# EAGLE design modEEGdigital_v1.1 (EAGLE 4.09)
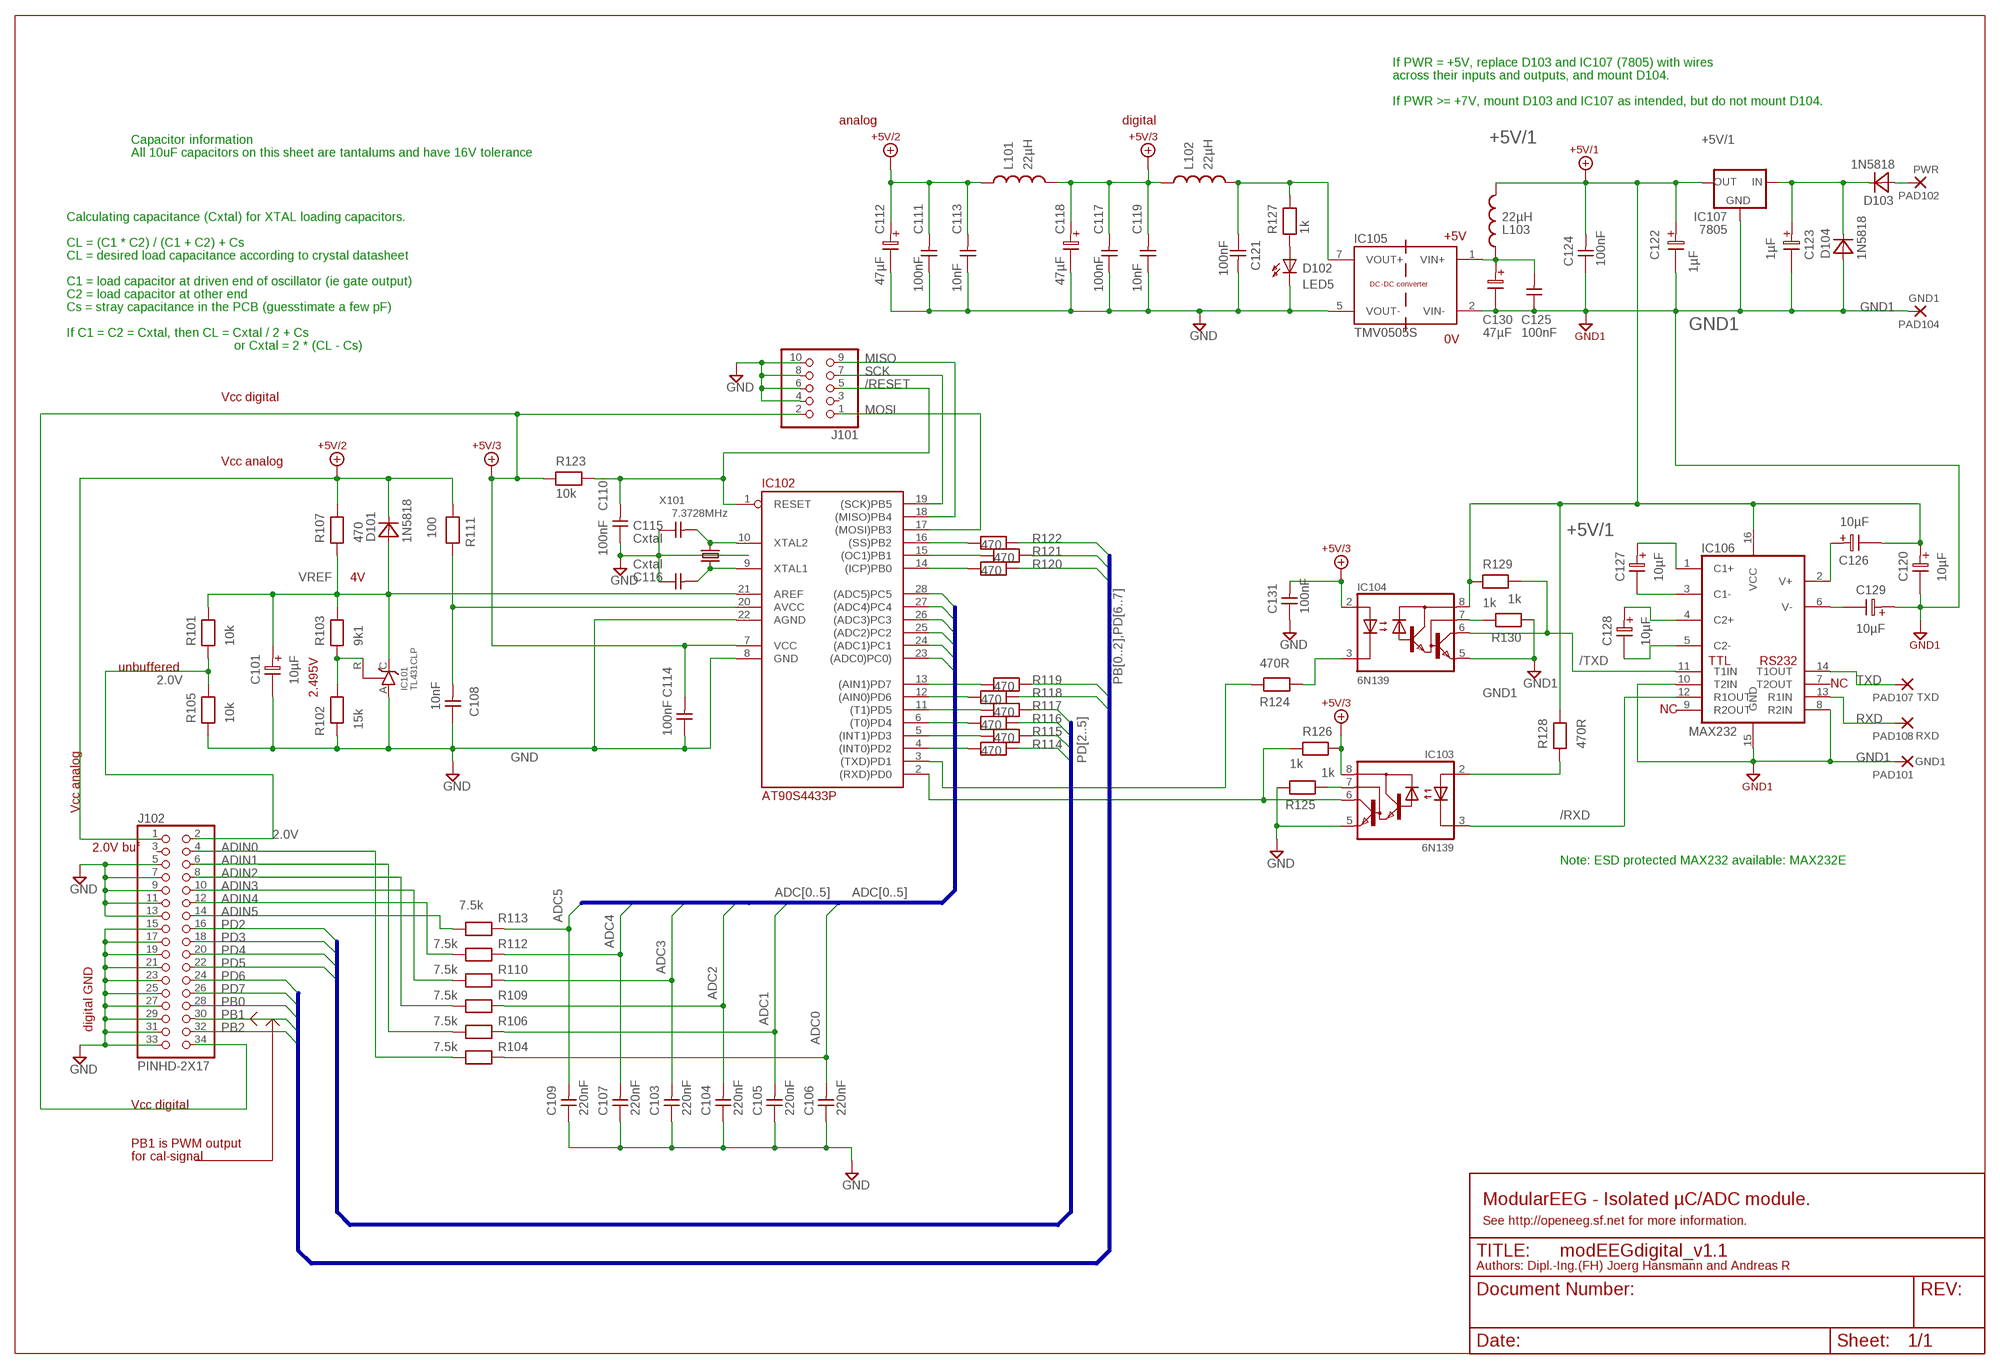
[diagram p0: schematic, sheet 1]

## Parts
C101  10µF  ELC-5  [EL25B]
C103  220nF  CAPNP-5  [C-5]
C104  220nF  CAPNP-5  [C-5]
C105  220nF  CAPNP-5  [C-5]
C106  220nF  CAPNP-5  [C-5]
C107  220nF  CAPNP-5  [C-5]
C108  10nF  CAPNP-5  [C-5]
C109  220nF  CAPNP-5  [C-5]
C110  100nF  CAPNP-5  [C-5]
C111  100nF  CAPNP-5  [C-5]
C112  47µF  ELC-5  [EL25B]
C113  10nF  CAPNP-5  [C-5]
C114  100nF  CAPNP-5  [C-5]
C115  Cxtal  CAPNP-5  [C-5]
C116  Cxtal  CAPNP-5  [C-5]
C117  100nF  CAPNP-5  [C-5]
C118  47µF  ELC-5  [EL25B]
C119  10nF  CAPNP-5  [C-5]
C120  10µF  ELC-5  [EL25B]
C121  100nF  CAPNP-5@2  [C-5@1]
C122  1µF  ELC-2,5  [EL25B]
C123  1µF  ELC-2,5  [EL25B]
C124  100nF  CAPNP-5@2  [C-5@1]
C125  100nF  CAPNP-5  [C-5]
C126  10µF  ELC-5  [EL25B]
C127  10µF  ELC-5  [EL25B]
C128  10µF  ELC-5  [EL25B]
C129  10µF  ELC-5  [EL25B]
C130  47µF  ELC-5  [EL25B]
C131  100nF  CAPNP-5  [C-5]
D101  1N5818  DIODE-10  [D-10]
D102  LED5  [LED5]
D103  1N5818  DIODE-12,5  [D-12,5]
D104  1N5818  DIODE-12,5  [D-12,5]
IC101  TL431CLP  [TO92-CLP]
IC102  AT90S4433P  90S4433-P  [DIL-28/3]
IC103  6N139  HCPL0700  [DIL-08]
IC104  6N139  HCPL0700  [DIL-08]
IC105  TMV0505S  TMV0505  [TMADCDC]
IC106  MAX232  [DIL-16]
IC107  7805  78XXS  [78XXL_S]
J101  PINHD-2X5  [2X05]
J102  PINHD-2X17  [2X17]
L101  22µH  L-10  [R-12,5]
L102  22µH  L-10  [R-12,5]
L103  22µH  L-10  [R-12,5]
PAD101  GND1  1,6/0,8  [WIREPAD1]
PAD102  PWR  1,6/0,8  [WIREPAD1]
PAD104  GND1  1,6/0,8  [WIREPAD1]
PAD107  TXD  1,6/0,8  [WIREPAD1]
PAD108  RXD  1,6/0,8  [WIREPAD1]
R101  10k  RESEU-10  [R-10]
R102  15k  RESEU-10  [R-10]
R103  9k1  RESEU-10  [R-10]
R104  7.5k  RESEU-10  [R-10]
R105  10k  RESEU-10  [R-10]
R106  7.5k  RESEU-10  [R-10]
R107  470  RESEU-10  [R-10]
R109  7.5k  RESEU-10  [R-10]
R110  7.5k  RESEU-10  [R-10]
R111  100  RESEU-10  [R-10]
R112  7.5k  RESEU-10  [R-10]
R113  7.5k  RESEU-10  [R-10]
R114  470  RESEU-10  [R-10]
R115  470  RESEU-10  [R-10]
R116  470  RESEU-10  [R-10]
R117  470  RESEU-10  [R-10]
R118  470  RESEU-10  [R-10]
R119  470  RESEU-10  [R-10]
R120  470  RESEU-10  [R-10]
R121  470  RESEU-10  [R-10]
R122  470  RESEU-10  [R-10]
R123  10k  RESEU-10@2  [R-10]
R124  470R  RESEU-10  [R-10]
R125  1k  RESEU-10  [R-10]
R126  1k  RESEU-10  [R-10]
R127  1k  RESEU-10@2  [R-10]
R128  470R  RESEU-10  [R-10]
R129  1k  RESEU-10  [R-10]
R130  1k  RESEU-10  [R-10]
X101  7.3728MHz  HC49/S  [HC49/S]

## Nets
2.0V: J102.2 R101.1 R105.2
+5V/1: C120.1 C122.1 C124.2 C126.2 IC104.8(VCC) IC106.16(VCC) IC107.OUT L103.2 R128.2 R129.1
+5V/2: C111.2 C112.1 C113.2 D101.2(K) J102.1 L101.1 R107.2 R111.1
+5V/3: C114.2 C117.2 C118.1 C119.2 C131.2 IC102.7(VCC) IC103.8(VCC) IC104.2(A) J101.2 J102.34 L101.2 L102.1 R123.1 R126.2
+6TO12V: C123.1 D103.2(K) D104.2(K) IC107.IN
/RESET: C110.2 IC102.1(RESET) J101.5 R123.2
/RXD: IC103.3(K) IC106.12(R1OUT)
/TXD: IC104.6(VO) IC106.11(T1IN) R129.2
ADC0: C106.2 IC102.23((ADC0)PC0)) R104.2
ADC1: C105.2 IC102.24((ADC1)PC1) R106.2
ADC2: C104.2 IC102.25((ADC2)PC2) R109.2
ADC3: C103.2 IC102.26((ADC3)PC3) R110.2
ADC4: C107.2 IC102.27((ADC4)PC4) R112.2
ADC5: C109.2 IC102.28((ADC5)PC5) R113.2
ADIN0: J102.4 R104.1
ADIN1: J102.6 R106.1
ADIN2: J102.8 R109.1
ADIN3: J102.10 R110.1
ADIN4: J102.12 R112.1
ADIN5: J102.14 R113.1
AVCC: C108.2 IC102.20(AVCC) R111.2
GND: C101.2 C103.1 C104.1 C105.1 C106.1 C107.1 C108.1 C109.1 C110.1 C111.1 C112.2 C113.1 C114.1 C115.1 C116.1 C117.1 C118.2 C119.1 C121.2 C131.1 D102.K IC101.A IC102.8(GND) IC102.22(AGND) IC103.5(GND) IC105.5(VOUT-) J101.4 J101.6 J101.8 J101.10 J102.5 J102.7 J102.9 J102.11 J102.13 J102.15 J102.17 J102.19 J102.21 J102.23 J102.25 J102.27 J102.29 J102.31 J102.33 R102.1 R105.1 R125.2
GND1: C120.2 C122.2 C123.2 C124.1 C125.1 C129.1 C130.2 D104.1(A) IC104.5(GND) IC105.2(VIN-) IC106.8(R2IN) IC106.10(T2IN) IC106.15(GND) IC107.GND PAD101.1(P) PAD104.1(P) R130.1
MISO: IC102.18((MISO)PB4) J101.9
MOSI: IC102.17((MOSI)PB3) J101.1
N$1: IC102.4((INT0)PD2) R114.1
N$2: IC102.5((INT1)PD3) R115.1
N$3: IC102.6((T0)PD4) R116.1
N$4: IC101.R R102.2 R103.1
N$5: IC102.11((T1)PD5) R117.1
N$6: IC102.12((AIN0)PD6) R118.1
N$7: IC102.13((AIN1)PD7) R119.1
N$8: IC104.3(K) R124.1
N$9: IC102.14((ICP)PB0) R120.1
N$10: C116.2 IC102.9(XTAL1) X101.1
N$11: IC102.15((OC1)PB1) R121.1
N$12: IC102.16((SS)PB2) R122.1
N$14: C121.1 IC105.7(VOUT+) L102.2 R127.2
N$15: D102.A R127.1
N$18: D103.1(A) PAD102.1(P)
N$25: C115.2 IC102.10(XTAL2) X101.2
N$36: C128.1 IC106.4(C2+)
N$37: C128.2 IC106.5(C2-)
N$38: C127.2 IC106.3(C1-)
N$40: C127.1 IC106.1(C1+)
N$42: C129.2 IC106.6(V-)
N$43: C126.1 IC106.2(V+)
N$44: C125.2 C130.1 IC105.1(VIN+) L103.1
N$52: IC104.7(VB) R130.2
N$53: IC103.7(VB) R125.1
N$61: IC103.2(A) R128.1
PB0: J102.28 R120.2
PB1: J102.30 R121.2
PB2: J102.32 R122.2
PD0: IC102.2((RXD)PD0) IC103.6(VO) R126.1
PD1: IC102.3((TXD)PD1) R124.2
PD2: J102.16 R114.2
PD3: J102.18 R115.2
PD4: J102.20 R116.2
PD5: J102.22 R117.2
PD6: J102.24 R118.2
PD7: J102.26 R119.2
RXD: IC106.13(R1IN) PAD108.1(P)
SCK: IC102.19((SCK)PB5) J101.7
TXD: IC106.14(T1OUT) PAD107.1(P)
VREF: C101.1 D101.1(A) IC101.C IC102.21(AREF) R101.2 R103.2 R107.1
Unconnected: IC106.7(T2OUT) IC106.9(R2OUT) J101.3 J102.3

## Buses
ADC[0..5]
PD[2..5]
PB[0..2],PD[6..7]

## Notes on the sheet
- If PWR = +5V, replace D103 and IC107 (7805) with wires
- across their inputs and outputs, and mount D104.
- If PWR >= +7V, mount D103 and IC107 as intended, but do not mount D104.
- analog | digital
- Capacitor information
- All 10uF capacitors on this sheet are tantalums and have 16V tolerance
- Calculating capacitance (Cxtal) for XTAL loading capacitors.
- +5V
- CL = (C1 * C2) / (C1 + C2) + Cs
- CL = desired load capacitance according to crystal datasheet
- C1 = load capacitor at driven end of oscillator (ie gate output)
- C2 = load capacitor at other end
- Cs = stray capacitance in the PCB (guesstimate a few pF)
- If C1 = C2 = Cxtal, then CL = Cxtal / 2 + Cs
- 0V
- or Cxtal = 2 * (CL - Cs)
- Vcc digital
- Vcc analog
- 4V
- TTL | RS232
- unbuffered
- NC
- 2.495V
- NC
- Vcc analog
- 2.0V buf
- Note: ESD protected MAX232 available: MAX232E
- digital GND
- Vcc digital
- PB1 is PWM output
- for cal-signal
- ModularEEG - Isolated µC/ADC module.
- See http://openeeg.sf.net for more information.
- Authors: Dipl.-Ing.(FH) Joerg Hansmann and Andreas R

## Library data of the parts
C101 C112 C118 C120 C126-C130 = DISCRETE:ELC-5
C103-C111 C113-C117 C119 C125 C131 = DISCRETE:CAPNP-5
C121 C124 = DISCRETE:CAPNP-5@2
C122 C123 = DISCRETE@2:ELC-2,5
D101 = DISCRETE:DIODE-10
D102 = LED:LED5
D103 D104 = DISCRETE:DIODE-12,5
IC101 = V-REG:TL431CLP
IC102 = atmel:90S4433-P
IC103 IC104 = OPTOCPL:HCPL0700
IC105 = modEEG:TMV0505
IC106 = MAXIM:MAX232
IC107 = V-REG@2:78XXS
J101 = PINHEAD:PINHD-2X5: PIN HEADER
J102 = PINHEAD@2:PINHD-2X17
L101-L103 = DISCRETE@2:L-10
PAD101 PAD102 PAD104 PAD107 PAD108 = WIREPAD:1,6/0,8
R101-R107 R109-R122 R124-R126 R128-R130 = DISCRETE:RESEU-10
R123 R127 = DISCRETE:RESEU-10@2
X101 = QUARTZ:HC49/S

## Board
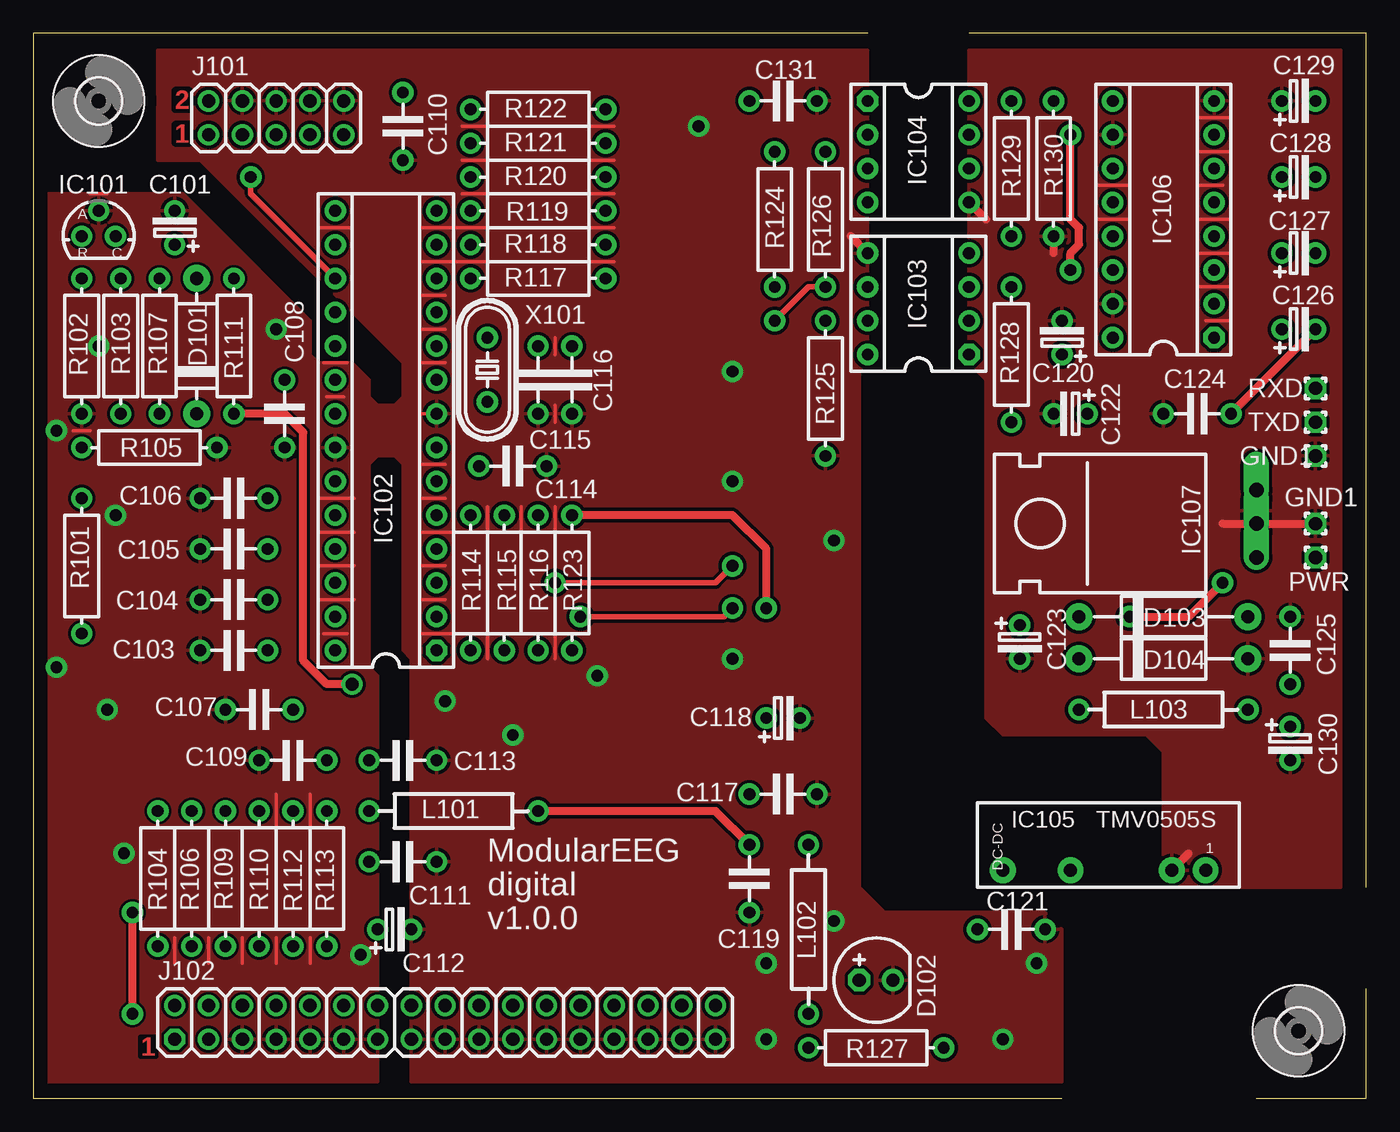
[diagram p1: board, top side]
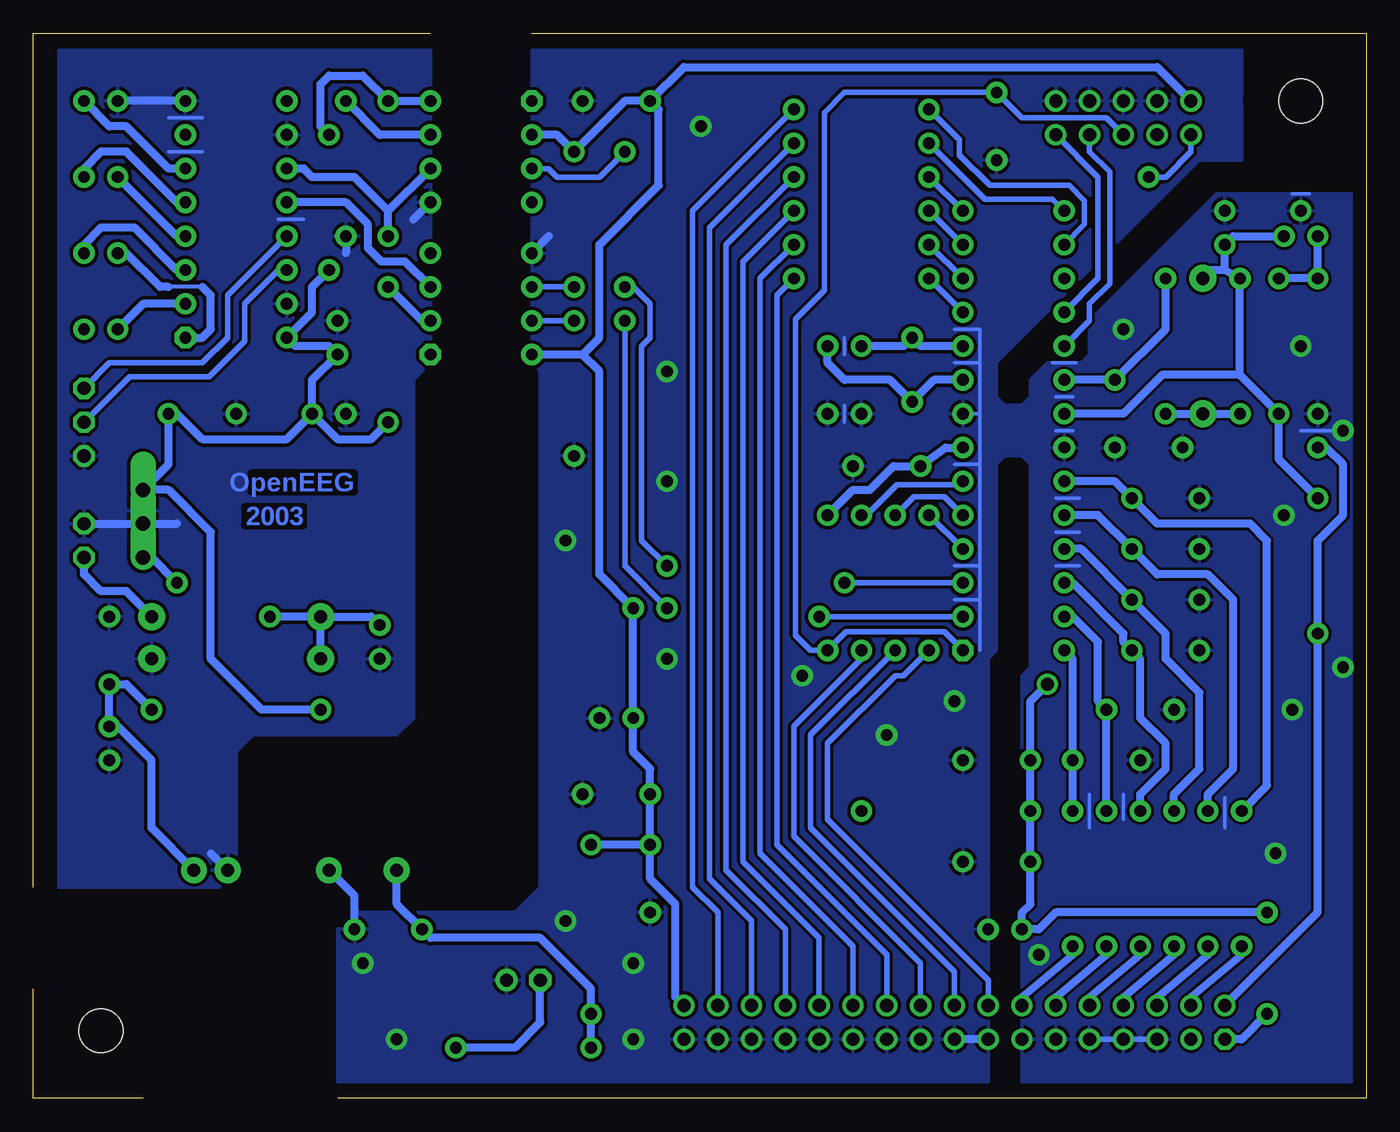
[diagram p2: board, bottom side, seen from below]

Size 100.16 x 80.01 mm. Coordinates in mm from the lower left corner, seen from the top.
Outline: 77.3,0 0,0 0,80.01 62.7,80.01 62.71,80
Outline: 91.91,0 100.16,0 100.16,8.26
Outline: 100.16,15.88 100.16,80.01 70.32,80.01 70.31,80
Copper layers used: Top, Bottom

### Footprints (pad centres in the part's own frame; a part is rotated, then mirrored left to right if it is on the bottom)
EL25B = drill 0.889 pad 1.6 round: 1 -1.27,0; 2 1.27,0
C-5 = drill 0.889 pad 1.6 round: 1 -2.54,0; 2 2.54,0
D-10 = drill 0.991 pad 2.032 round: 1 -5.08,0; 2 5.08,0
LED5 = drill 0.991 pad 1.676 octagon: A -1.27,0 | drill 0.991 pad 1.676 round: K 1.27,0
D-12,5 = drill 0.991 pad 2.032 round: 1 -6.35,0; 2 6.35,0
TO92-CLP = drill 0.889 pad 1.6 round: A 0,1.905; C 1.27,0; R -1.27,0
DIL-28/3 = drill 0.889 pad 1.6 octagon: 1 -16.51,-3.81 | drill 0.889 pad 1.6 round: 2 -13.97,-3.81; 3 -11.43,-3.81; 4 -8.89,-3.81; 5 -6.35,-3.81; 6 -3.81,-3.81; 7 -1.27,-3.81; 8 1.27,-3.81; 9 3.81,-3.81; 10 6.35,-3.81; 11 8.89,-3.81; 12 11.43,-3.81; 13 13.97,-3.81; 14 16.51,-3.81; 15 16.51,3.81; 16 13.97,3.81; 17 11.43,3.81; 18 8.89,3.81; 19 6.35,3.81; 20 3.81,3.81; 21 1.27,3.81; 22 -1.27,3.81; 23 -3.81,3.81; 24 -6.35,3.81; 25 -8.89,3.81; 26 -11.43,3.81; 27 -13.97,3.81; 28 -16.51,3.81
DIL-08 = drill 0.889 pad 1.6 octagon: 1 -3.81,-3.81 | drill 0.889 pad 1.6 round: 2 -1.27,-3.81; 3 1.27,-3.81; 4 3.81,-3.81; 5 3.81,3.81; 6 1.27,3.81; 7 -1.27,3.81; 8 -3.81,3.81
TMADCDC = drill 0.991 pad 1.93 round: 1 1.27,6.35; 2 1.27,3.81; 5 1.27,-3.81; 7 1.27,-8.89
DIL-16 = drill 0.889 pad 1.6 octagon: 1 -8.89,-3.81 | drill 0.889 pad 1.6 round: 2 -6.35,-3.81; 3 -3.81,-3.81; 4 -1.27,-3.81; 5 1.27,-3.81; 6 3.81,-3.81; 7 6.35,-3.81; 8 8.89,-3.81; 9 8.89,3.81; 10 6.35,3.81; 11 3.81,3.81; 12 1.27,3.81; 13 -1.27,3.81; 14 -3.81,3.81; 15 -6.35,3.81; 16 -8.89,3.81
78XXL_S = drill 1.092 pad 1.905 offset: GND 0,-0.635; IN -2.54,-0.635; OUT 2.54,-0.635
2X05 = drill 0.991 pad 1.6 round: 1 -5.08,-1.27; 2 -5.08,1.27; 3 -2.54,-1.27; 4 -2.54,1.27; 5 0,-1.27; 6 0,1.27; 7 2.54,-1.27; 8 2.54,1.27; 9 5.08,-1.27; 10 5.08,1.27
2X17 = drill 0.991 pad 1.6 octagon: 1 -20.32,-1.27 | drill 0.991 pad 1.6 round: 2 -20.32,1.27; 3 -17.78,-1.27; 4 -17.78,1.27; 5 -15.24,-1.27; 6 -15.24,1.27; 7 -12.7,-1.27; 8 -12.7,1.27; 9 -10.16,-1.27; 10 -10.16,1.27; 11 -7.62,-1.27; 12 -7.62,1.27; 13 -5.08,-1.27; 14 -5.08,1.27; 15 -2.54,-1.27; 16 -2.54,1.27; 17 0,-1.27; 18 0,1.27; 19 2.54,-1.27; 20 2.54,1.27; 21 5.08,-1.27; 22 5.08,1.27; 23 7.62,-1.27; 24 7.62,1.27; 25 10.16,-1.27; 26 10.16,1.27; 27 12.7,-1.27; 28 12.7,1.27; 29 15.24,-1.27; 30 15.24,1.27; 31 17.78,-1.27; 32 17.78,1.27; 33 20.32,-1.27; 34 20.32,1.27
R-12,5 = drill 0.889 pad 1.6 round: 1 -6.35,0; 2 6.35,0
WIREPAD1 = drill 0.991 pad 1.6 octagon: 1 0,0
R-10 = drill 0.889 pad 1.6 round: 1 -5.08,0; 2 5.08,0
3,3 = hole 3.3: 0,0
HC49/S = drill 0.889 pad 1.6 round: 1 -2.413,0; 2 2.413,0

### Placement (x,y rotation side)
C101  10.63,65.41 90 top
C103  15.08,33.66 0 top
C104  15.08,37.47 0 top
C105  15.08,41.27 0 top
C106  15.08,45.09 0 top
C107  16.98,29.21 0 top
C108  18.88,51.44 90 top
C109  19.52,25.4 0 top
C110  27.77,73.03 90 top
C111  27.77,17.78 180 top
C112  27.14,12.7 0 top
C113  27.77,25.4 180 top
C114  36.03,47.5 180 top
C115  37.94,53.98 90 top
C116  40.48,53.98 90 top
C117  56.35,22.86 180 top
C118  56.35,28.57 0 top
C119  53.81,16.51 90 top
C120  77.3,57.15 90 top
C121  100nF  [C-5]  73.5,12.7 0 top
C122  77.94,51.44 180 top
C123  74.13,34.29 270 top
C124  100nF  [C-5]  87.47,51.44 0 top
C125  94.45,33.66 270 top
C126  95.08,57.78 0 top
C127  95.08,63.5 0 top
C128  95.08,69.22 0 top
C129  95.08,74.93 0 top
C130  94.45,26.67 270 top
C131  56.35,74.93 180 top
D101  12.28,56.52 270 top
D102  63.34,8.89 0 top
D103  84.92,36.2 180 top
D104  84.92,33.02 180 top
IC101  4.92,64.77 0 top
IC102  26.5,50.16 90 top
IC103  66.51,59.69 90 top
IC104  66.51,71.12 270 top
IC105  81.75,18.41 270 top
IC106  84.92,66.04 90 top
IC107  91.28,43.18 90 top
J101  18.25,73.66 0 top
J102  30.95,5.71 0 top
L101  31.58,21.59 0 top
L102  58.25,12.7 270 top
L103  84.92,29.21 180 top
PAD101  96.36,48.26 0 top
PAD102  96.36,40.64 90 top
PAD104  96.36,43.18 90 top
PAD107  96.36,50.8 90 top
PAD108  96.36,53.34 90 top
R101  3.64,40.01 90 top
R102  3.64,56.52 90 top
R103  6.57,56.52 270 top
R104  9.36,16.51 90 top
R105  8.73,48.9 180 top
R106  11.9,16.51 90 top
R107  9.49,56.52 270 top
R109  14.44,16.51 90 top
R110  16.98,16.51 90 top
R111  15.08,56.52 90 top
R112  19.52,16.51 90 top
R113  22.06,16.51 90 top
R114  32.85,38.73 270 top
R115  35.39,38.73 270 top
R116  37.94,38.73 270 top
R117  37.94,61.59 0 top
R118  37.94,64.14 0 top
R119  37.94,66.67 0 top
R120  37.94,69.22 0 top
R121  37.94,71.75 0 top
R122  37.94,74.3 0 top
R123  40.48,38.73 270 top
R124  55.71,66.04 270 top
R125  59.52,53.34 270 top
R126  59.52,66.04 90 top
R127  63.34,3.81 180 top
R128  73.5,55.88 270 top
R129  73.5,69.85 270 top
R130  76.67,69.85 90 top
U$16  [3,3]  95.08,5.08 0 top
U$17  [3,3]  4.92,74.93 0 top
X101  34.12,54.74 90 top

### Tracks (layer width: path | path; a pad name or v marks a point on that pad's centre or on a via)
2.0V
  Bottom 0.61: R105.2 3.01,48.9 1.74,47.62 1.74,43.81 3.64,41.91 R101.1 3.64,13.97 J102.2
+5V/1  (via drill 0.89 pad 1.6)
  Top 0.61: v77.94,72.39 77.94,66.04 78.58,65.41 78.58,64.14 77.94,63.5 v77.94,62.23 | C124.2 C126.2
  Bottom 0.61: IC104.8 R129.1 75.4,76.83 77.94,76.83 78.58,76.2 78.58,73.03 v77.94,72.39 | v77.94,62.23 79.21,60.96 79.21,59.05 IC106.16 80.48,56.52 77.94,56.52 C120.1 79.21,53.98 C122.1 | C122.1 81.11,49.53 87.47,49.53 89.37,51.44 C124.2 90,47.62 IC107.OUT 90,45.72 86.83,42.55 86.83,33.02 83.02,29.21 L103.2 | R128.2 74.77,49.53 77.3,49.53 C122.1
+5V/2  (via drill 0.89 pad 1.6, 0.99 pad 1.6)
  Top 0.61: v7.46,6.35 v7.46,13.97 | v23.96,31.11 22.06,31.11 20.28,32.89 20.28,50.04 18.88,51.44 R111.1
  Bottom 0.61: J102.1 9.36,4.45 v7.46,6.35 | v7.46,13.97 23.33,13.97 24.6,12.7 C112.1 25.87,13.97 25.23,14.61 C111.2 L101.1 C113.2 25.23,29.84 v23.96,31.11 | R111.1 D101.2 R107.2
+5V/3  (via drill 0.89 pad 1.6)
  Top 0.61: R123.1 52.54,43.81 55.08,41.27 v55.08,36.83 | L101.2 51.27,21.59 C119.2
  Bottom 0.61: IC102.7 31.58,48.9 C114.2 35.52,47.5 37.3,45.72 38.57,45.72 R123.1 | IC104.2 60.8,72.39 R126.2 55.71,74.93 C131.2 | C131.2 51.27,77.47 15.71,77.47 J101.2 | C119.2 L102.1 | C119.2 53.81,16.51 51.91,14.61 51.91,7.62 J102.34 | C119.2 C117.2 53.81,24.77 55.08,26.04 C118.1 v55.08,36.83 57.62,39.37 57.62,54.61 58.89,55.88 | C131.2 53.17,74.3 53.17,68.58 57.62,64.14 57.62,57.15 58.89,55.88 | 58.89,55.88 IC103.8
+6TO12V  (via drill 0.89 pad 1.6)
  Top 0.61: v82.39,36.2 86.83,36.2 v89.37,38.73
  Bottom 0.61: C123.1 74.77,36.2 D103.2 | D104.2 D103.2 | D103.2 v82.39,36.2 | v89.37,38.73 91.28,40.64 IC107.IN
/RESET
  Bottom 0.406: IC102.1 31.71,35.05 39.08,35.05 R123.2 41.74,33.66 42.89,34.8 42.89,58.55 40.73,60.71 40.73,74.04 39.2,75.56 C110.2 25.87,73.66 19.52,73.66 J101.5
/RXD
  Bottom 0.61: IC103.3 72.22,62.87 74,62.87 75.02,63.88 75.02,65.66 76.67,67.31 IC106.12
/TXD
  Bottom 0.61: R129.2 73.5,66.67 | 73.5,66.67 IC104.6 | 73.5,66.67 76.03,69.22 79.21,69.22 79.84,69.85 IC106.11
ADC0
  Bottom 0.61: IC102.23 18.88,46.35 C106.2 15.71,43.18 8.73,43.18 7.46,41.91 7.46,23.5 R104.2
ADC1
  Bottom 0.61: R106.2 11.9,22.86 10,24.77 10,37.47 11.9,39.37 15.71,39.37 C105.2 20.15,43.81 IC102.24
ADC2
  Bottom 0.61: IC102.25 21.42,41.27 C104.2 15.08,34.92 15.08,33.02 12.54,30.48 12.54,24.77 14.44,22.86 R109.2
ADC3
  Bottom 0.61: IC102.26 22.06,38.73 18.25,34.92 18.25,34.29 C103.2 16.98,33.02 16.98,28.57 15.08,26.67 15.08,24.77 16.98,22.86 R110.2
ADC4
  Bottom 0.61: R112.2 C107.2 20.15,29.84 20.15,34.29 22.06,36.2 IC102.27
ADC5
  Bottom 0.61: R113.2 C109.2 22.06,33.02 IC102.28
ADIN0
  Bottom 0.61: R104.1 9.36,10.79 13.17,7.62 J102.4
ADIN1
  Bottom 0.61: R106.1 11.9,10.79 15.71,7.62 J102.6
ADIN2
  Bottom 0.61: R109.1 14.44,10.79 18.25,7.62 J102.8
ADIN3
  Bottom 0.61: R110.1 16.98,10.79 20.79,7.62 J102.10
ADIN4
  Bottom 0.61: R112.1 19.52,10.79 23.33,7.62 J102.12
ADIN5
  Bottom 0.61: R113.1 22.06,10.79 25.87,7.62 J102.14
AVCC
  Bottom 0.61: IC102.20 C108.2 15.08,57.78 R111.2
GND  (via drill 0.89 pad 1.6)
  Top 0.254: 39.2,55.88 39.2,57.15 | 39.2,50.8 39.2,52.07 | 29.04,55.24 30.95,55.24 | 29.04,57.78 30.95,57.78 | 30.95,60.33 29.04,60.33 29.04,57.78 | 34.12,62.87 29.04,62.87 29.04,65.41 34.12,65.41 34.12,67.94 | 34.12,67.94 32.22,67.94 | 41.74,67.94 43.65,67.94 | 41.74,70.48 43.65,70.48 | 41.74,65.41 43.65,65.41 | 43.65,62.87 41.74,62.87 41.74,65.41 | 34.12,70.48 32.22,70.48 | 32.22,73.03 34.12,73.03 34.12,70.48 | 43.65,73.03 41.74,73.03 41.74,70.48 | 29.04,51.44 IC102.8 | 29.04,47.62 30.95,47.62 | 29.04,45.09 30.95,45.09 | 29.04,40.01 30.95,40.01 | 31.58,34.92 31.58,33.02 | 34.12,33.02 34.12,34.92 | 34.12,42.55 34.12,44.45 | 36.66,42.55 36.66,44.45 | 39.2,44.45 39.2,42.55 36.66,42.55 | 29.04,37.47 30.95,37.47 | 39.2,33.02 39.2,34.92 29.04,34.92 29.04,37.47 | 40.22,34.92 41.74,34.92 | 4.28,67.94 5.55,67.94 | 4.28,50.16 3.01,50.16 | 29.04,37.47 29.04,40.01 | 29.04,40.01 29.04,45.09 | 29.04,45.09 29.04,47.62 | 29.04,47.62 29.04,51.44 | 29.04,51.44 29.04,55.24 | 29.04,55.24 29.04,57.78 | 29.04,42.55 34.12,42.55 | 34.12,42.55 36.66,42.55 | 41.74,67.94 41.74,70.48 | 41.74,65.41 41.74,67.94 | 34.12,67.94 34.12,70.48 | 20.79,10.16 20.79,12.06 | 18.25,10.16 18.25,12.06 | 15.71,10.16 15.71,12.06 | 13.17,10.16 13.17,12.06 | 10.63,12.06 10.63,10.16 | 21.55,45.09 24.09,45.09 | 21.55,42.55 24.09,42.55 | 21.55,40.01 24.09,40.01 | 21.55,37.47 24.09,37.47 | 21.81,34.92 23.58,34.92 | 21.81,55.24 23.58,55.24 | 22.06,52.7 23.33,52.7 | 21.42,65.41 23.96,65.41 | 18.25,20.32 18.25,22.86 | 20.79,20.32 20.79,22.86
  Top 0.61: IC103.5 61.43,64.77
  Bottom 0.254: 30.95,57.78 29.04,57.78 29.04,55.24 | 39.2,55.88 39.2,57.15 | 29.04,55.24 30.95,55.24 | 39.2,50.8 39.2,52.07 | IC102.8 29.04,51.44 | 29.04,47.62 30.95,47.62 | 29.04,40.01 30.95,40.01 | 29.04,37.47 30.95,37.47 | 21.81,55.24 23.58,55.24 | 2.38,50.16 4.92,50.16 | 4.28,67.94 5.55,67.94 | 29.04,51.44 29.04,47.62 | 29.04,47.62 29.04,40.01 | 29.04,40.01 29.04,37.47 | 29.04,37.47 29.04,33.66 | 29.04,51.44 29.04,55.24 | 21.55,45.09 23.33,45.09 | 21.55,42.55 23.33,42.55 | 21.55,40.01 23.33,40.01 | 22.06,52.7 23.33,52.7 | 10.63,22.61 10.63,20.32 | 18.25,20.95 18.25,22.86 | 20.79,20.32 20.79,22.86 | 22.06,50.16 23.33,50.16
  Bottom 0.406: J102.9 J102.7 J102.5
  Bottom 0.61: J102.15 J102.17 | IC103.5 61.43,64.77 | C121.2 76.03,15.24 IC105.5
  other vias: 52.54,54.61 1.74,32.38 5.55,29.21 4.92,56.52 18.25,57.78 6.18,43.81 72.86,4.45 42.38,31.75 30.95,29.84 36.03,27.3 55.08,10.16 60.16,13.34 52.54,46.35 60.16,41.91 1.74,50.16 50,73.03 55.08,4.45 6.82,18.41 24.6,10.79 52.54,33.02 75.4,10.16
  pour Bottom (isolate 0.254): 28.41,1.27 77.3,1.27 77.3,12.7 76.03,13.97 63.97,13.97 62.06,15.88 62.06,54.61 62.7,55.24 62.7,78.74 9.36,78.74 9.36,70.48 12.54,70.48 27.77,55.24 27.77,33.66 28.41,33.02
  pour Top (isolate 0.254): 9.36,78.74 62.7,78.74 62.7,55.24 62.06,54.61 62.06,15.88 63.97,13.97 76.03,13.97 77.3,12.7 77.3,1.27 28.41,1.27 28.41,33.02 27.77,33.66 27.77,55.24 12.54,70.48 9.36,70.48
  pour Bottom: 1.1,67.94 1.1,1.27 25.87,1.27 25.87,31.75 25.23,32.38 25.23,53.98 23.96,55.24 21.42,55.24 20.79,55.88 20.79,58.42 11.27,67.94
  pour Top: 1.1,67.94 11.27,67.94 20.79,58.42 20.79,55.88 21.42,55.24 23.96,55.24 25.23,53.98 25.23,32.38 25.87,31.75 25.87,1.27 1.1,1.27
  pour Bottom (isolate 0.356): 22.7,52.7 25.23,52.7 25.87,52.07 27.14,52.07 27.77,52.7 30.31,52.7 30.31,47.62 27.77,47.62 27.14,48.26 25.87,48.26 25.23,47.62 22.7,47.62
  pour Top (isolate 0.356): 22.7,52.7 25.23,52.7 25.87,52.07 27.14,52.07 27.77,52.7 30.31,52.7 30.31,47.62 27.77,47.62 27.14,48.26 25.87,48.26 25.23,47.62 22.7,47.62
GND1
  Top 0.254: 79.84,68.58 82.39,68.58 | 88.1,58.42 90,58.42 | 87.47,63.5 90,63.5 | 87.47,66.04 90,66.04 | 87.47,68.58 89.37,68.58 | 87.47,71.12 90,71.12 | 87.47,73.66 90,73.66 | 79.84,66.04 82.39,66.04 | 87.47,60.96 90,60.96
  Top 0.61: IC105.2 86.83,18.41 | 89.37,43.18 PAD104.1 | IC104.5 71.59,66.04 | R130.1 76.67,63.5
  Bottom 0.254: 79.84,66.04 81.75,66.04 | 87.47,73.66 90,73.66 | 87.47,71.12 90,71.12
  Bottom 0.61: IC106.8 C129.1 | IC105.2 86.83,18.41 | PAD104.1 89.37,43.18 | IC104.5 71.59,66.04 | R130.1 76.67,63.5
  pour Bottom (isolate 0.254): 70.32,78.74 98.26,78.74 98.26,15.88 86.19,15.88 84.92,17.14 84.92,26.04 83.66,27.3 72.86,27.3 71.59,28.57 71.59,53.98 70.32,55.24
  pour Top (isolate 0.254): 70.32,78.74 98.26,78.74 98.26,15.88 86.19,15.88 84.92,17.14 84.92,26.04 83.66,27.3 72.86,27.3 71.59,28.57 71.59,53.98 70.32,55.24
MISO
  Bottom 0.406: J101.9 20.15,69.22 20.15,61.59 IC102.18
MOSI  (via drill 0.89 pad 1.6)
  Top 0.406: v16.34,69.22 16.34,67.94 IC102.17
  Bottom 0.406: v16.34,69.22 15.08,69.22 13.17,71.12 J101.1
N$1
  Bottom 0.406: IC102.4 R114.1
N$2
  Bottom 0.406: IC102.5 31.71,45.21 34,45.21 R115.1
N$3
  Bottom 0.406: IC102.6 30.57,46.1 35.27,46.1 37.55,43.81 R116.1
N$4
  Bottom 0.61: R103.1 R102.2 IC101.R
N$5
  Bottom 0.406: IC102.11 R117.1
N$6
  Bottom 0.406: IC102.12 R118.1
N$7
  Bottom 0.406: IC102.13 R119.1
N$8
  Bottom 0.406: R124.1 57.62,69.22 60.8,69.22 61.43,69.85 IC104.3
N$9
  Bottom 0.406: IC102.14 R120.1
N$10
  Bottom 0.61: IC102.9 32.47,53.98 X101.1 35.78,53.98 39.2,53.98 40.48,55.24 C116.2
N$11
  Bottom 0.406: IC102.15 23.58,67.56 28.66,67.56 R121.1
N$12
  Bottom 0.406: R122.1 30.57,72.01 30.57,70.87 28.28,68.58 22.31,68.58 21.17,67.44 21.17,65.66 IC102.16
N$14
  Bottom 0.61: IC105.7 72.86,14.61 C121.1 70.32,12.06 62.06,12.06 58.25,8.26 L102.2 R127.2
N$15
  Bottom 0.61: D102.A 62.06,5.71 63.97,3.81 R127.1
N$18
  Bottom 0.61: D103.1 93.18,38.1 95.08,38.1 96.36,39.37 PAD102.1
N$25
  Bottom 0.61: IC102.10 33.49,56.52 X101.2 34.76,56.52 C115.2
N$36
  Bottom 0.61: IC106.4 89.37,64.77 C128.1
N$37
  Bottom 0.61: IC106.5 89.37,67.31 93.18,71.12 95.08,71.12 96.36,69.85 C128.2
N$38
  Bottom 0.61: IC106.3 89.37,62.23 92.55,65.41 95.08,65.41 96.36,64.14 C127.2
N$40
  Bottom 0.305: 87.47,60.96 90,60.96
  Bottom 0.61: IC106.1 87.47,57.15 86.83,57.78 86.83,60.33 87.47,60.96 | 90,60.96 90.64,60.96 93.18,63.5 C127.1
N$42
  Bottom 0.61: C129.2 94.45,73.03 93.18,73.03 90,69.85 IC106.6
N$43
  Bottom 0.61: IC106.2 91.91,59.69 C126.1
N$44
  Bottom 0.61: IC105.1 91.28,20.32 91.28,25.4 93.81,27.94 C130.1 C125.2 93.18,31.11 L103.1
N$52
  Bottom 0.61: IC104.7 74.13,72.39 R130.2
N$53
  Bottom 0.406: R125.1 IC103.7
N$61
  Bottom 0.61: IC103.2 70.95,58.42 R128.1
PB0
  Bottom 0.406: R120.2 48.09,64.14 48.09,17.14 43.65,12.7 J102.28
PB1
  Bottom 0.406: R121.2 49.37,65.41 49.37,16.51 46.19,13.34 J102.30
PB2
  Bottom 0.406: R122.2 50.63,66.67 50.63,15.88 48.73,13.97 J102.32
PD0  (via drill 0.89 pad 1.6)
  Top 0.406: v41.11,36.2 51.91,36.2 v52.54,36.83 | R126.1 58.25,60.96 v55.71,58.42
  Bottom 0.406: IC102.2 v41.11,36.2 | R126.1 IC103.6 | v52.54,36.83 55.71,40.01 v55.71,58.42
PD1  (via drill 0.89 pad 1.6)
  Top 0.406: v39.2,38.73 51.27,38.73 v52.54,40.01
  Bottom 0.406: IC102.3 v39.2,38.73 | v52.54,40.01 54.45,41.91 54.45,56.52 53.81,57.15 53.81,59.69 55.08,60.96 R124.2
PD2
  Bottom 0.406: R114.2 34.76,31.75 35.39,31.75 40.48,26.67 40.48,20.95 28.41,8.89 J102.16
PD3
  Bottom 0.406: R115.2 41.74,27.3 41.74,20.32 30.95,9.53 J102.18
PD4
  Bottom 0.406: R116.2 37.94,33.02 43.02,27.94 43.02,19.68 33.49,10.16 J102.20
PD5
  Bottom 0.406: R117.2 44.28,60.33 44.28,19.05 36.03,10.79 J102.22
PD6
  Bottom 0.406: R118.2 45.55,61.59 45.55,18.41 38.57,11.43 J102.24
PD7
  Bottom 0.406: R119.2 46.82,62.87 46.82,17.78 41.11,12.06 J102.26
RXD
  Bottom 0.406: IC106.13 85.56,60.33 85.56,57.15 87.47,55.24 94.45,55.24 PAD108.1
SCK
  Bottom 0.406: IC102.19 20.79,58.42 20.79,59.69 19.27,61.21 19.27,69.6 20.79,71.12 J101.7
TXD
  Bottom 0.406: IC106.14 81.75,62.23 84.29,59.69 84.29,56.9 86.96,54.23 92.93,54.23 PAD107.1
VREF
  Bottom 0.61: R101.2 6.57,48.01 R103.2 9.49,54.36 | 9.49,54.36 15.33,54.36 18.25,51.44 IC102.21 | IC101.C 10,64.77 C101.1 10.63,62.23 | 9.49,54.36 R107.1 10.63,62.23 | D101.1 11.65,62.23 10.63,62.23

### Text on the board
Top: 2 | 1 | 1
Bottom: OpenEEG | 2003
tNames: ModularEEG | digital | v1.0.0